# EAGLE design xbee (EAGLE 4.13)
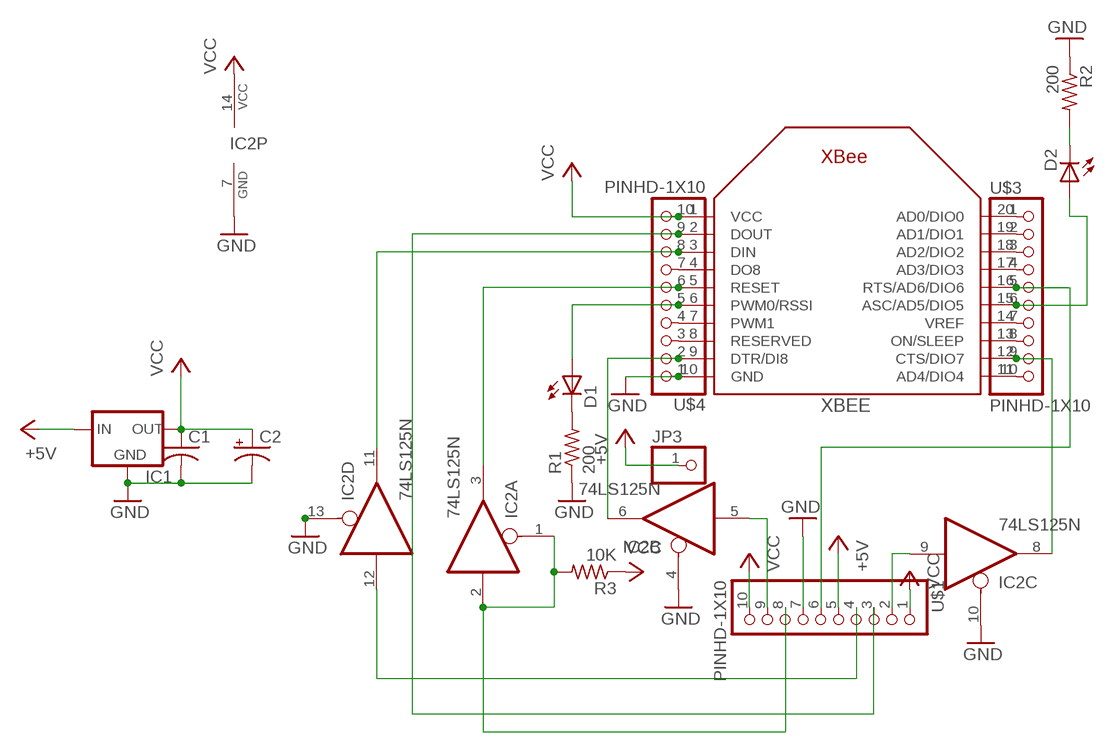
[diagram p0: schematic, sheet 1]

## Parts
C1  C-US025-025X050  [C025-025X050]
C2  CPOL-USE2.5-5  [E2,5-5]
D1  LED3MM  [LED3MM]
D2  LED3MM  [LED3MM]
IC1  MC1700  [TO92]
IC2  74LS125N  [DIL14]
JP3  PINHD-1X1  [1X01]
R1  200  R-US_0207/10  [0207/10]
R2  200  R-US_0207/10  [0207/10]
R3  10K  R-US_0207/10  [0207/10]
U$1  PINHD-1X10  [1X10-BIG]
U$3  PINHD-1X10  [1X10-BIG]
U$4  PINHD-1X10  [1X10-BIG]
XBEE  XBEE  [XBEE]

## Nets
+5V: IC1.2(IN) JP3.1 U$1.5
GND: C1.2 C2.- IC1.1(GND) IC2.4(B:OE) IC2.7(P:GND) IC2.10(C:OE) IC2.13(D:OE) R1.1 R2.1 U$1.7 U$4.1 XBEE.10(GND)
N$1: IC2.12(D:I) U$1.4
N$2: IC2.11(D:O) U$4.8 XBEE.3(DIN)
N$3: IC2.5(B:I) U$1.9
N$4: IC2.8(C:O) U$3.9 XBEE.12(CTS/DIO7)
N$5: D2.K(C) R2.2
N$6: U$4.7 XBEE.4(DO8)
N$7: D1.A U$4.5 XBEE.6(PWM0/RSSI)
N$8: D1.K(C) R1.2
N$9: D2.A U$3.6 XBEE.15(ASC/AD5/DIO5)
N$10: IC2.6(B:O) U$4.2 XBEE.9(DTR/DI8)
N$11: U$4.3 XBEE.8(RESERVED)
N$12: U$4.4 XBEE.7(PWM1)
N$13: IC2.3(A:O) U$4.6 XBEE.5(RESET)
N$14: U$3.1 XBEE.20(AD0/DIO0)
N$15: U$3.2 XBEE.19(AD1/DIO1)
N$16: U$3.3 XBEE.18(AD2/DIO2)
N$17: U$3.4 XBEE.17(AD3/DIO3)
N$18: U$3.7 XBEE.14(VREF)
N$19: U$3.8 XBEE.13(ON/SLEEP)
N$20: U$3.10 XBEE.11(AD4/DIO4)
N$21: IC2.9(C:I) U$1.2
RESET: IC2.1(A:OE) IC2.2(A:I) R3.2 U$1.8
RTS: U$1.6 U$3.5 XBEE.16(RTS/AD6/DIO6)
TX: U$1.3 U$4.9 XBEE.2(DOUT)
VCC: C1.1 C2.+ IC1.3(OUT) IC2.14(P:VCC) R3.1 U$1.1 U$1.10 U$4.10 XBEE.1(VCC)

## Library data of the parts
C1 = rcl-ez:C-US: CAPACITOR, American symbol
C2 = rcl-ez:CPOL-US: POLARIZED CAPACITOR, American symbol
D1 D2 = minimidi:LED: LED OSRAM: - CHIPLED LG R971, LG N971, LY N971, LG Q971, LY Q971, LO R971, LY R971 LH N974, LH R974 LS Q976, LO Q976, LY Q976 LO Q996 - Hyper CHIPLED LW Q18S LB Q993, LB Q99A, LB R99A - SideLED LS A670, LO A670, LY A670, LG A670, LP A670 LB A673, LV A673, LT A673, LW A673 LH A674 LY A675 LS A676, LA A676, LO A676, LY A676, LW A676 LS A679, LY A679, LG A679 - Hyper Micro SIDELED® LS Y876, LA Y876, LO Y876, LY Y876 LT Y87S - SmartLED LW L88C, LW L88S LB L89C, LB L89S, LG L890 LS L89K, LO L89K, LY L89K LS L896, LA L896, LO L896, LY L896 - TOPLED LS T670, LO T670, LY T670, LG T670, LP T670 LSG T670, LSP T670, LSY T670, LOP T670, LYG T670 LG T671, LOG T671, LSG T671 LB T673, LV T673, LT T673, LW T673 LH T674 LS T676, LA T676, LO T676, LY T676, LB T676, LH T676, LSB T676, LW T676 LB T67C, LV T67C, LT T67C, LS T67K, LO T67K, LY T67K, LW E67C LS E67B, LA E67B, LO E67B, LY E67B, LB E67C, LV E67C, LT E67C LW T67C LS T679, LY T679, LG T679 LS T770, LO T770, LY T770, LG T770, LP T770 LB T773, LV T773, LT T773, LW T773 LH T774 LS E675, LA E675, LY E675, LS T675 LS T776, LA T776, LO T776, LY T776, LB T776 LHGB T686 LT T68C, LB T68C - Hyper Mini TOPLED® LB M676 - Mini TOPLED Santana® LG M470 LS M47K, LO M47K, LY M47K Source: http://www.osram.convergy.de/
IC1 = ulink:MC1700: VOLTAGE REGULATOR
IC2 = 74xx-us:74*125: Quad bus BUFFER, 3-state
JP3 = digg:PINHD-1X1: PIN HEADER
R1-R3 = rcl-ez:R-US_: RESISTOR, American symbol
U$1 U$3 U$4 = ybox2:PINHD-1X10
XBEE = ulink:XBEE

## Board
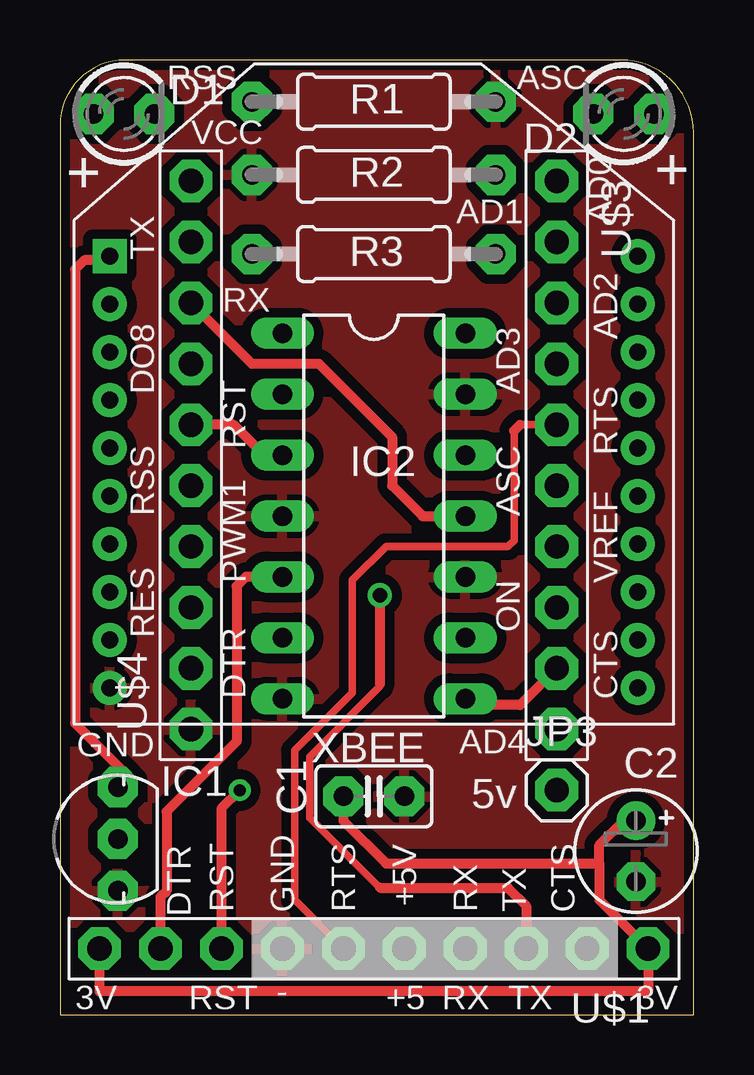
[diagram p1: board, top side]
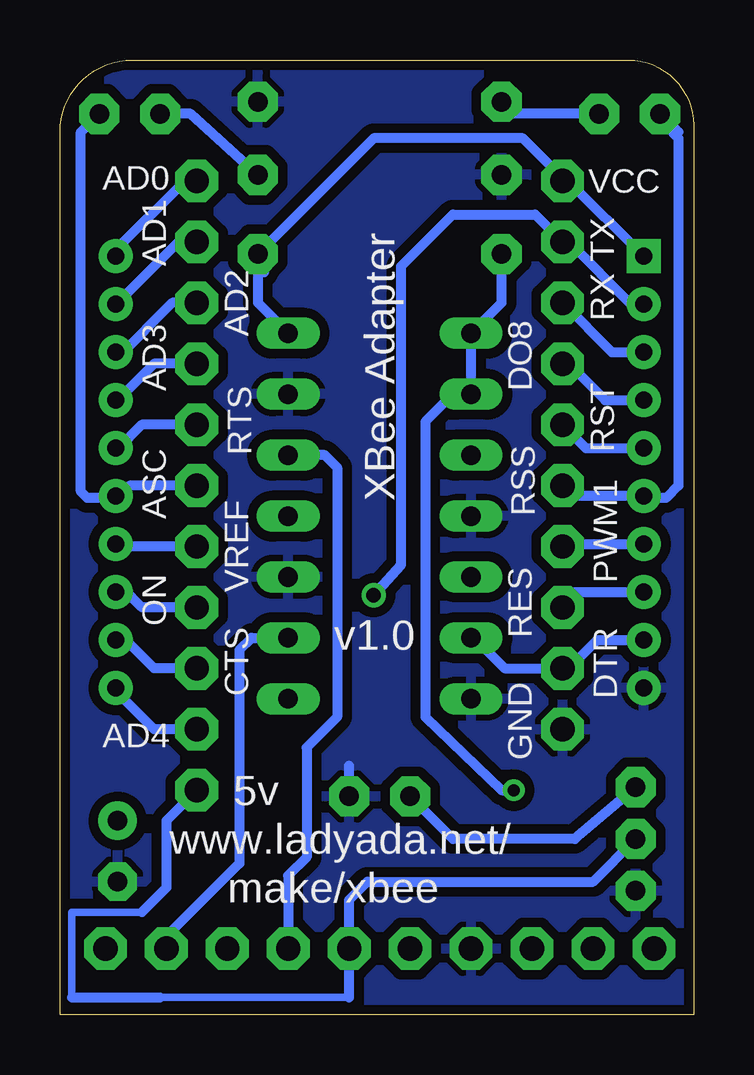
[diagram p2: board, bottom side, seen from below]

Size 26.4 x 39.8 mm. Coordinates in mm from the lower left corner, seen from the top.
Outline: 0,0 26.4,0 26.4,36.78 arc90 23.37,39.8 2.72,39.8 arc90 0,37.08 0,0
Copper layers (1*16): Top 0.035mm / dielectric 1.5mm / Bottom 0.035mm
Design rules "default": minimum track width 12mil, minimum drill 19mil, track to track 12mil, track to pad 12mil, pad to pad 12mil, via to via 12mil, smd to smd 0mil, copper to edge 10mil, drill to drill 8mil, minimum pad ring 10mil, minimum via ring 8mil, stop-mask expansion 4mil, vias tented up to drill 0mil, thermal gap 10mil

### Footprints (pad centres in the part's own frame; a part is rotated, then mirrored left to right if it is on the bottom)
C025-025X050 = drill 0.813 pad 1.676 octagon: 1 -1.27,0; 2 1.27,0
E2,5-5 = drill 0.813 pad 1.6 round: + -1.27,0 | drill 0.813 pad 1.6 octagon: - 1.27,0
LED3MM = drill 0.813 pad 1.676 octagon: A -1.27,0; K 1.27,0
TO92 = drill 0.813 pad 1.676 octagon: 1 -2.159,0; 2 0,0; 3 2.159,0
DIL14 = drill 0.813 long: 1 -7.62,-3.81; 2 -5.08,-3.81; 3 -2.54,-3.81; 4 0,-3.81; 5 2.54,-3.81; 6 5.08,-3.81; 7 7.62,-3.81; 8 7.62,3.81; 9 5.08,3.81; 10 2.54,3.81; 11 0,3.81; 12 -2.54,3.81; 13 -5.08,3.81; 14 -7.62,3.81
1X01 = drill 1.016 pad 1.778 octagon: 1 0,0
0207/10 = drill 0.813 pad 1.676 octagon: 1 -5.08,0; 2 5.08,0
1X10-BIG = drill 1.016 pad 1.778 octagon: 1 -11.43,0; 2 -8.89,0; 3 -6.35,0; 4 -3.81,0; 5 -1.27,0; 6 1.27,0; 7 3.81,0; 8 6.35,0; 9 8.89,0; 10 11.43,0
XBEE = drill 0.7 pad 1.422 square: 1 -11,5.5 | drill 0.7 pad 1.422 round: 2 -11,3.5; 3 -11,1.5; 4 -11,-0.5; 5 -11,-2.5; 6 -11,-4.5; 7 -11,-6.5; 8 -11,-8.5; 9 -11,-10.5; 10 -11,-12.5; 11 11,-12.5; 12 11,-10.5; 13 11,-8.5; 14 11,-6.5; 15 11,-4.5; 16 11,-2.5; 17 11,-0.5; 18 11,1.5; 19 11,3.5; 20 11,5.5

### Placement (x,y rotation side)
C1  13.08,9.11 0 top
C2  24,6.82 270 top
D1  2.66,37.55 0 top
D2  23.49,37.55 180 top
IC1  2.41,7.33 90 top
IC2  13.08,20.79 270 top
JP3  20.7,9.36 0 top
R1  13.08,38.06 180 top
R2  13.08,35.01 0 top
R3  13.08,31.71 180 top
U$1  13.08,2.76 180 top
U$3  20.7,23.33 270 top
U$4  5.46,23.33 90 top
XBEE  13.08,26.12 0 top

### Tracks (layer width: path | path; a pad name or v marks a point on that pad's centre or on a via)
+5V
  Bottom 0.305: JP3.1 21.2,8.85 | 22.22,0.72 14.35,0.72 | 22.98,4.28 25.9,4.28 25.9,0.72
  Bottom 0.406: 14.35,0.72 U$1.5 14.35,4.79 13.58,5.55 4.19,5.55 IC1.2 | 21.2,8.85 21.97,8.09 21.97,5.3 22.98,4.28 | 25.9,0.72 22.22,0.72
GND
  Bottom 0.406: C1.2 14.35,10.38
  pour Bottom (isolate 0.406): 0.12,-0.04 26.54,-0.04 26.54,39.84 0.12,39.84
  pour Top (isolate 0.406): 0.12,0.22 26.54,0.22 26.54,39.84 0.12,39.84
N$1
  Bottom 0.406: IC2.12 15.36,23.33 14.85,22.82 14.85,12.41 16.12,11.14 16.12,6.57 16.89,5.8 U$1.4
N$2
  Top 0.406: 17.14,20.79 IC2.11 15.11,20.79 13.84,22.06 13.84,24.09 10.79,27.14 8,27.14 U$4.8
  Bottom 0.406: XBEE.3 3.4,27.62 U$4.8
N$3
  Top 0.406: IC2.5 7.74,18.25 7.36,17.87 7.36,11.39 4.44,8.47 4.44,5.17 4.19,4.92 U$1.9
N$4
  Top 0.406: IC2.8 17.14,12.92 19.17,12.92 U$3.9
  Bottom 0.406: XBEE.12 23.83,15.62 23.74,15.71 22.47,14.44 U$3.9
N$5
  Bottom 0.406: R2.2 20.95,37.55 D2.K
N$6
  Bottom 0.406: XBEE.4 3.69,25.62 5.2,27.14 5.2,27.39 5.46,27.39 | 5.71,27.39 5.46,27.39 | 5.46,27.39 U$4.7
N$7
  Bottom 0.406: 0.76,36.92 0.63,36.79 | D1.A 0.76,36.92 | U$4.5 5.02,21.62 XBEE.6 2,21.55 1.14,21.55 0.63,22.06 0.63,36.54 0.88,36.79 0.76,36.92
N$8
  Bottom 0.406: R1.2 7.74,37.55 D1.K
N$9
  Bottom 0.406: D2.A 25.52,36.79 25.52,21.81 25.27,21.55 24.15,21.55 XBEE.15 24,21.55 23.49,22.06 U$3.6
N$10
  Bottom 0.406: XBEE.9 4.02,15.62 5.2,14.44 U$4.2 7.87,14.44 9.27,15.84 IC2.6
N$11
  Bottom 0.406: U$4.3 5.71,16.98 5.07,17.62 XBEE.8
N$12
  Bottom 0.406: XBEE.7 5.35,19.62 U$4.4
N$13
  Top 0.406: U$4.6 7.23,24.6 8.5,23.33 IC2.3
  Bottom 0.406: XBEE.5 4.48,23.62 U$4.6
N$14
  Bottom 0.406: XBEE.20 24.16,31.62 24.25,31.71 21.2,34.76 U$3.1
N$15
  Bottom 0.406: XBEE.19 24.05,29.62 21.46,32.22 U$3.2
N$16
  Bottom 0.406: XBEE.18 24.08,27.47 24,27.39 21.71,29.68 U$3.3
N$17
  Bottom 0.406: XBEE.17 24.01,25.62 24,25.62 22.47,27.14 U$3.4
N$18
  Bottom 0.406: XBEE.14 24.08,19.7 24,19.77 23.74,19.52 U$3.7
N$19
  Bottom 0.406: XBEE.13 23.86,17.62 23.74,17.74 22.98,16.98 U$3.8
N$20
  Bottom 0.406: 24.2,13.62 24.25,13.68 | 24.2,13.62 XBEE.11 | U$3.10 22.47,11.9 24.2,13.62
N$21
  Bottom 0.406: IC2.9 18.41,15.71 18.92,15.2 18.92,6.31 21.97,3.26 U$1.2
RESET  (via drill 0.5)
  Top 0.406: v7.49,9.36 6.73,8.6 U$1.8
  Bottom 0.406: v7.49,9.36 8,9.36 11.17,12.41 11.17,24.73 9.9,26 9.39,26 IC2.2 | IC2.2 8.76,25.87 | 8,31.84 R3.2 8,29.68 IC2.1 IC2.2
RTS
  Top 0.305: 18.92,24.35 18.92,19.77 18.66,19.52 13.58,19.52 12.19,18.12 12.19,13.42 9.77,11.01 9.77,4.79 U$1.6 | 19.17,24.6 U$3.5
  Top 0.406: 18.92,24.35 19.17,24.6
  Bottom 0.406: XBEE.16 24.04,23.62 24,23.58 22.98,24.6 U$3.5
TX  (via drill 0.6)
  Top 0.305: 13.33,5.3 10.41,8.22 10.41,10.76 13.33,13.68 13.33,13.8
  Top 0.406: v13.33,17.49 13.33,13.8 | 13.33,5.3 18.66,5.3 19.43,4.53 U$1.3
  Bottom 0.406: U$4.9 5.2,32.22 2.61,29.62 XBEE.2 | U$4.9 5.58,32.73 | v13.33,17.49 12.19,18.76 12.19,31.2 10.03,33.36 6.6,33.36 U$4.9
VCC
  Top 0.406: IC1.3 2.92,9.87 0.63,12.15 0.63,31.08 1.01,31.46 2.24,31.46 | C1.1 11.81,8.09 13.58,6.31 22.47,6.31 | 22.47,6.31 22.47,4.79 U$1.1 24.51,0.98 1.65,0.98 U$1.10 | 22.47,6.31 22.47,7.07 23.49,8.09 C2.+ | 2.24,31.46 2.41,31.46 | XBEE.1 2.24,31.46
  Bottom 0.406: IC1.3 4.95,7.33 10.03,7.33 C1.1 | 5.71,34.76 U$4.10 | XBEE.1 5.21,34.76 5.71,34.76 | R3.1 17.9,30.95 | IC2.14 18.16,29.68 R3.1 | 5.71,34.76 5.71,35.14 7.11,36.54 13.33,36.54 R3.1

### Text on the board
tPlace: DTR | +5V | RST | GND | RTS | RX | TX | 3V | 3V
bPlace: XBee Adapter | v1.0 | www.ladyada.net/ | make/xbee
tNames: ASC | RSS | VCC | + | AD1 | + | AD0 | TX | RX | AD2 | DO8 | AD3 | RST | RTS | RSS | ASC | PWM1 | VREF | RES | ON | DTR | CTS | GND | AD4 | 5v | CTS | RST | - | RX | +5 | TX
bNames: VCC | AD0 | TX | AD1 | RX | AD2 | DO8 | AD3 | RST | RTS | RSS | ASC | PWM1 | VREF | RES | ON | DTR | CTS | AD4 | GND | 5v